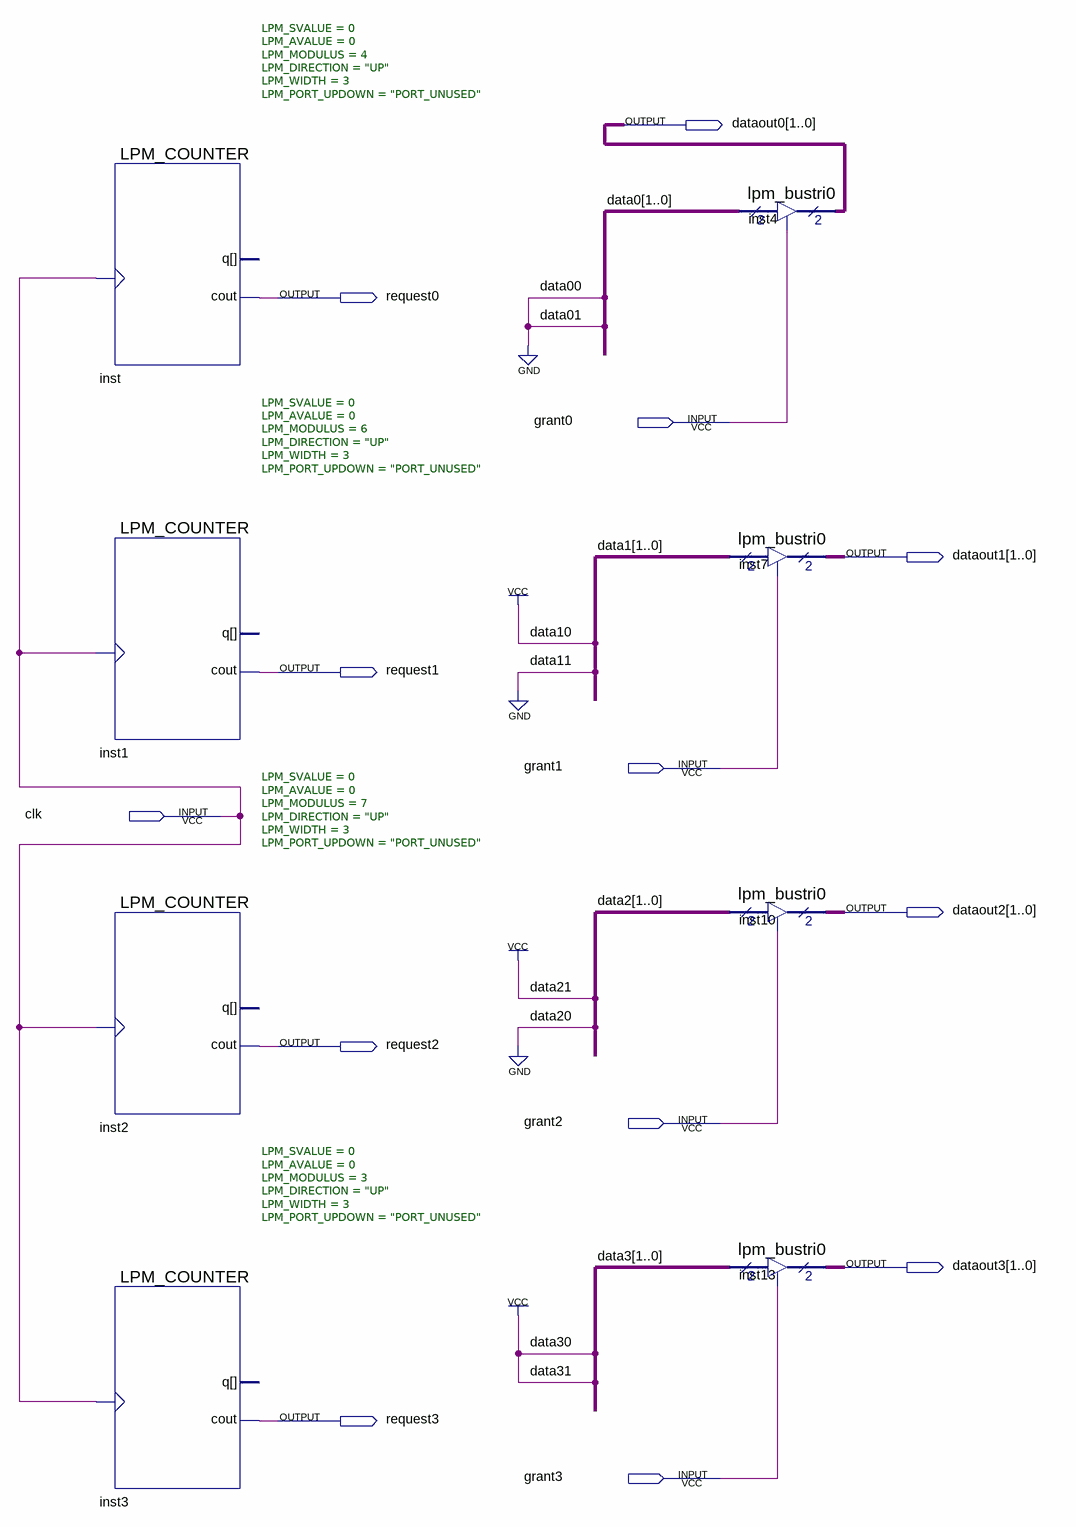
[diagram p0: schematic sheet]
// Quartus schematic Devices.bdf as structural Verilog: 8 symbols, 13 pins
module Devices (
  input  grant0,
  input  grant1,
  input  clk,
  input  grant2,
  input  grant3,
  output [1:0] dataout0,
  output request0,
  output [1:0] dataout1,
  output request1,
  output [1:0] dataout2,
  output request2,
  output [1:0] dataout3,
  output request3
);

  LPM_COUNTER #(.LPM_SVALUE(0), .LPM_AVALUE(0), .LPM_MODULUS(4), .LPM_DIRECTION("UP"), .LPM_WIDTH(3), .LPM_PORT_UPDOWN("PORT_UNUSED")) inst (
    .clock(clk), .cout(request0));  // open: q
  LPM_COUNTER #(.LPM_SVALUE(0), .LPM_AVALUE(0), .LPM_MODULUS(6), .LPM_DIRECTION("UP"), .LPM_WIDTH(3), .LPM_PORT_UPDOWN("PORT_UNUSED")) inst1 (
    .clock(clk), .cout(request1));  // open: q
  LPM_COUNTER #(.LPM_SVALUE(0), .LPM_AVALUE(0), .LPM_MODULUS(7), .LPM_DIRECTION("UP"), .LPM_WIDTH(3), .LPM_PORT_UPDOWN("PORT_UNUSED")) inst2 (
    .clock(clk), .cout(request2));  // open: q
  LPM_COUNTER #(.LPM_SVALUE(0), .LPM_AVALUE(0), .LPM_MODULUS(3), .LPM_DIRECTION("UP"), .LPM_WIDTH(3), .LPM_PORT_UPDOWN("PORT_UNUSED")) inst3 (
    .clock(clk), .cout(request3));  // open: q
  lpm_bustri0 inst4 (.enabledt(grant0), .data(2'b00), .tridata(dataout0));
  lpm_bustri0 inst7 (.enabledt(grant1), .data(2'b01), .tridata(dataout1));
  lpm_bustri0 inst10 (.enabledt(grant2), .data(2'b10), .tridata(dataout2));
  lpm_bustri0 inst13 (.enabledt(grant3), .data(2'b11), .tridata(dataout3));
endmodule
